# Altium schematic sheet [10] - ETHERNET.SchDoc
size A3; DocumentNumber: 2; SheetNumber: 10; SheetTotal: 20
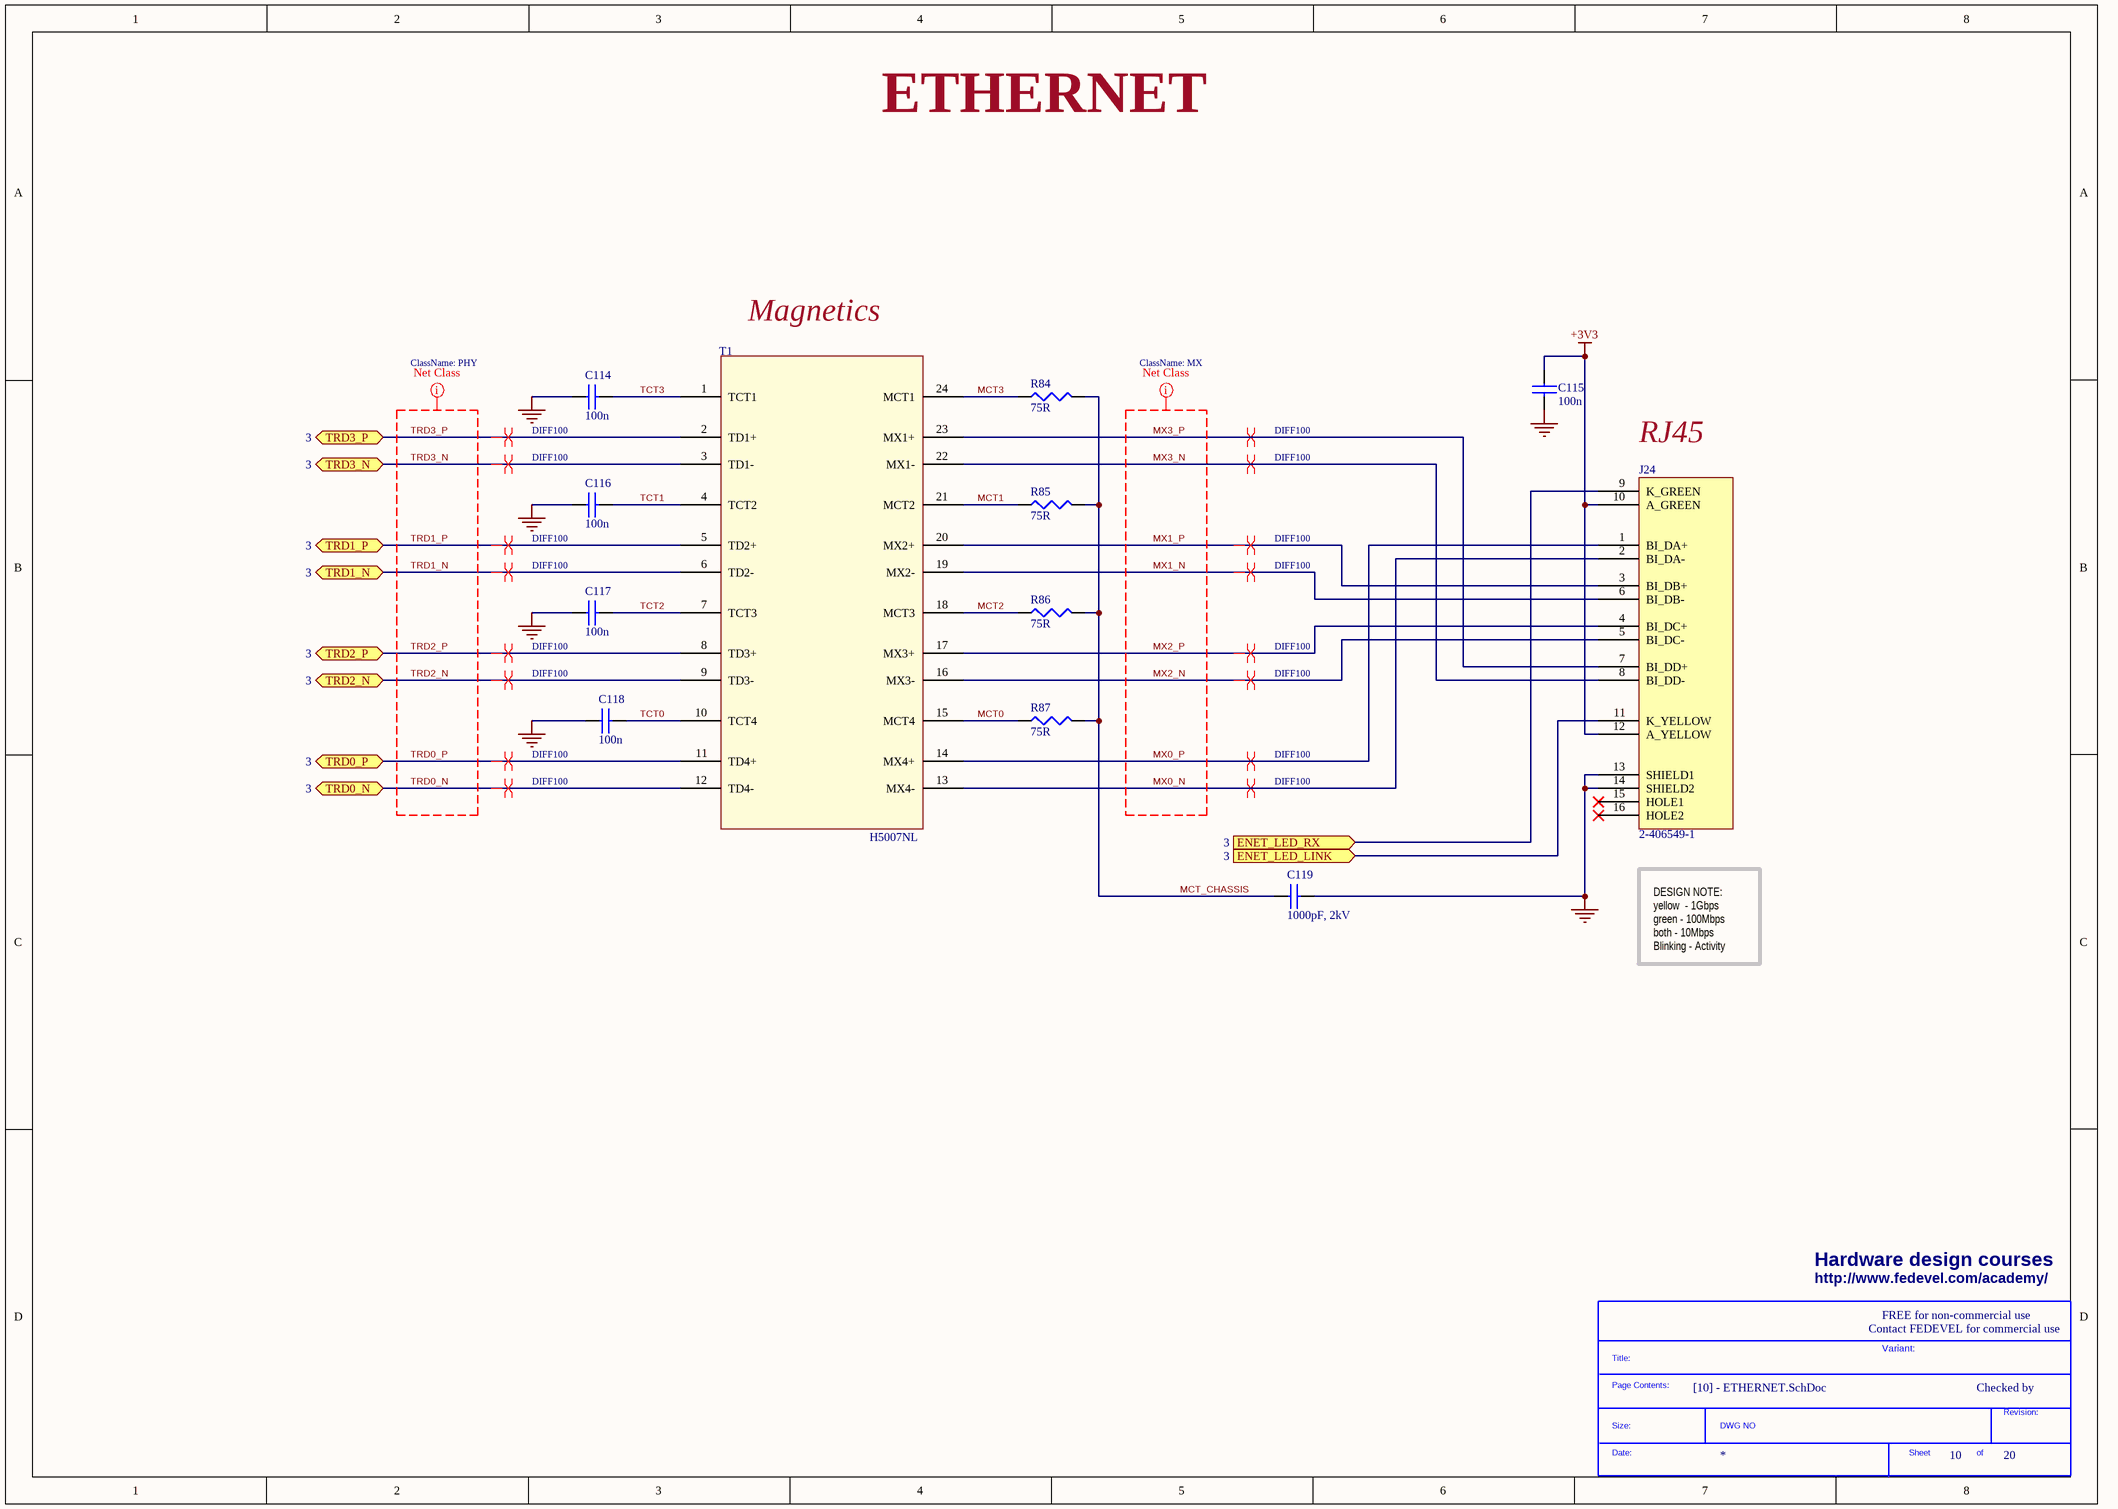
[diagram p0: [10] - ETHERNET.SchDoc]

## Parts
*  SDTitleBlock  (value not drawn)  (graphical)
C114  100n  [C0402]
C115  100n  [C0402]
C116  100n  [C0402]
C117  100n  [C0402]
C118  100n  [C0402]
C119  1000pF, 2kV  [C1206]
J24  2-406549-1  [RJ45LED]
R84  75R  [R0402]
R85  75R  [R0402]
R86  75R  [R0402]
R87  75R  [R0402]
T1  H5007NL  [H5007NL]

## Ports
ENET_LED_LINK (in, see 3), ENET_LED_RX (in, see 3), TRD0_N (bidir, see 3), TRD0_P (bidir, see 3), TRD1_N (bidir, see 3), TRD1_P (bidir, see 3), TRD2_N (bidir, see 3), TRD2_P (bidir, see 3), TRD3_N (bidir, see 3), TRD3_P (bidir, see 3)

## Nets
+3V3: C115.1 J24.10(A_GREEN) J24.12(A_YELLOW)
GND: C114.1 C115.2 C116.1 C117.1 C118.1 C119.2 J24.13(SHIELD1) J24.14(SHIELD2)
ENET_LED_LINK: J24.11(K_YELLOW) ; port ENET_LED_LINK
ENET_LED_RX: J24.9(K_GREEN) ; port ENET_LED_RX
MCT0: R87.1 T1.15(MCT4)
MCT1: R85.1 T1.21(MCT2)
MCT2: R86.1 T1.18(MCT3)
MCT3: R84.1 T1.24(MCT1)
MCT_CHASSIS: C119.1 R84.2 R85.2 R86.2 R87.2
MX0_N: J24.2(BI_DA-) T1.13(MX4-)
MX0_P: J24.1(BI_DA+) T1.14(MX4+)
MX1_N: J24.6(BI_DB-) T1.19(MX2-)
MX1_P: J24.3(BI_DB+) T1.20(MX2+)
MX2_N: J24.5(BI_DC-) T1.16(MX3-)
MX2_P: J24.4(BI_DC+) T1.17(MX3+)
MX3_N: J24.8(BI_DD-) T1.22(MX1-)
MX3_P: J24.7(BI_DD+) T1.23(MX1+)
TCT0: C118.2 T1.10(TCT4)
TCT1: C116.2 T1.4(TCT2)
TCT2: C117.2 T1.7(TCT3)
TCT3: C114.2 T1.1(TCT1)
TRD0_N: T1.12(TD4-) ; port TRD0_N
TRD0_P: T1.11(TD4+) ; port TRD0_P
TRD1_N: T1.6(TD2-) ; port TRD1_N
TRD1_P: T1.5(TD2+) ; port TRD1_P
TRD2_N: T1.9(TD3-) ; port TRD2_N
TRD2_P: T1.8(TD3+) ; port TRD2_P
TRD3_N: T1.3(TD1-) ; port TRD3_N
TRD3_P: T1.2(TD1+) ; port TRD3_P

Not connected (* = marked no-connect by the designer): J24 15(HOLE1)* 16(HOLE2)*

## Layout directives
differential pair; net class DIFF100: MX0_N, MX0_P, MX1_N, MX1_P, MX2_N, MX2_P, MX3_N, MX3_P, TRD0_N, TRD0_P, TRD1_N, TRD1_P, TRD2_N, TRD2_P, TRD3_N, TRD3_P
net class PHY: TRD0_N, TRD0_P, TRD1_N, TRD1_P, TRD2_N, TRD2_P, TRD3_N, TRD3_P
net class MX: MX0_N, MX0_P, MX1_N, MX1_P, MX2_N, MX2_P, MX3_N, MX3_P

## Notes on the sheet
- ETHERNET
- Magnetics
- (near J24) RJ45
- DESIGN NOTE:
  yellow  - 1Gbps
  green - 100Mbps
  both - 10Mbps
  Blinking - Activity
- Hardware design courses
- http://www.fedevel.com/academy/
- Contact FEDEVEL for commercial use
- FREE for non-commercial use
- Variant:
- Checked by
- (in symbol SDTitleBlock) Title:; Page Contents:; Revision:; Size:; DWG NO; Date:; Sheet; of

## Library data of the parts
C114-C118 = C1005X5R1H104K: CAP CER .10UF 50V X5R 10% 0402; Manufacturer: TDK Corporation; Capacitance: 0.1µF; Value: 100nF; .Checked PCB: used; Description: CAP CER 0.1UF 50V 10% X5R 0402; Category: Capacitors; Supplier Part Number: 445-5942-1-ND; Manufacturer Part Number: C1005X5R1H104K; Operating Temperature: -55°C ~ 85°C; Package / Case: 0402 (1005 Metric); Price 1k [$]: 0.02340; .Checked SCH: used; Voltage - Rated: 50V; Supplier: Digikey; Supplier 1: Digi-Key; Supplier Part Number 1: 445-5942-1-ND; RoHS: RoHS Compliant; Stock 1: 106926; Pricing 1: 1=0.27, 10=0.18, 100=0.072, 250=0.05176, 500=0.0369, 1000=0.027 (USD); Tolerance: ±10%; Temperature Coefficient: X5R; Mounting Type: Surface Mount, MLCC; Applications: General Purpose; Ratings: -; Size / Dimension: 0.039" L x 0.020" W (1.00mm x 0.50mm); Height - Seated (Max): -; Thickness (Max): 0.022" (0.55mm); Lead Spacing: -; Features: -; Packaging: Cut Tape (CT); Lead Style: -; ComponentLink1URL: http://www.tdk.co.jp/tefe02/e412_c.pdf; ComponentLink1Description: http://www.tdk.co.jp/tefe02/e412_c.pdf
C119 = C1206X102KGRACTU: CAP CER 1000PF 2000V X7R 1206 FT; Manufacturer: Kemet; .Checked PCB: used; Voltage - Rated: 2000V (2kV); Description: CAP CER 1000PF 2KV 10% X7R 1206; Tolerance: ±10%; Capacitance: 1000pF; Category: Capacitors; Supplier Part Number: 399-5830-1-ND; Manufacturer Part Number: C1206X102KGRACTU; Operating Temperature: -55°C ~ 125°C; Package / Case: 1206 (3216 Metric); Price 1k [$]: 0.27600; Value: 1000pF, 2kV; .Checked SCH: used; Supplier: Digikey; Supplier 1: Digi-Key; Supplier Part Number 1: 399-5830-1-ND; RoHS: RoHS Compliant; Stock 1: 2068; Pricing 1: 1=0.92, 10=0.771, 25=0.6324, 100=0.483, 250=0.37952, 500=0.345, 1000=0.276 (USD); Temperature Coefficient: X7R; Mounting Type: Surface Mount, MLCC; Applications: Boardflex Sensitive; Ratings: -; Size / Dimension: 0.134" L x 0.063" W (3.40mm x 1.60mm); Height - Seated (Max): -; Thickness (Max): 0.069" (1.75mm); Lead Spacing: -; Features: Soft Termination, High Voltage; Packaging: Cut Tape (CT); Lead Style: -; ComponentLink1URL: http://www.kemet.com/kemet/web/homepage/kechome.nsf/weben/8311688D32A99EF8852578B500644843/$file/KEM_CC105_HIVOLT.pdf; ComponentLink1Description: http://www.kemet.com/kemet/web/homepage/kechome.nsf/weben/8311688D32A99EF8852578B500644843/$file/KEM_CC105_HIVOLT.pdf
J24 = 2-406549-1: CONN MOD JACK 8POS R/A G-Y PCB; Manufacturer: Tyco; .Checked PCB: used; Number of Positions: 8p8c (RJ45, Ethernet); Description: CONN MOD JACK 8POS R/A Y-G PCB; Number of Ports: 1; Shielding: Shielded, EMI Finger; Ratings: Cat5; LED Color: Yellow - Green; Tab Direction: Up; .Checked SCH: used; Category: Connectors, Interconnects; Connector Type: Jack; Manufacturer Part Number: 2-406549-1; Price 1k [$]: 1.73278; Supplier: Digikey; Supplier Part Number: A97715-ND; Value: 2-406549-1; Supplier 1: Digi-Key; Supplier Part Number 1: A97715-ND; RoHS: RoHS Compliant; Stock 1: 9021; Pricing 1: 1=3.42 (USD); Number of Positions/Contacts: 8p8c (RJ45, Ethernet); Number of Rows: 1; Mounting Type: Through Hole; Orientation: 90° Angle (Right); Termination: Solder; Features: Board Lock; Packaging: Tray; Housing Material: Thermoplastic; Contact Material: Phosphor Bronze; Contact Finish: Gold; Operating Temperature: -40°C ~ 85°C; ComponentLink1URL: http://documents.tycoelectronics.com/commerce/DocumentDelivery/DDEController?Action=srchrtrv&DocNm=406549&DocType=CD&DocLang=EN; ComponentLink1Description: http://documents.tycoelectronics.com/commerce/DocumentDelivery/DDEController?Action=srchrtrv&DocNm=406549&DocType=CD&DocLang=EN
R84-R87 = RC0402FR-0775RL: RES 75.0 OHM 1/16W 1% 0402 SMD; Manufacturer: Yageo; Resistance (Ohms): 75; Power (Watts): 0.063W, 1/16W; .Checked PCB: used; Temperature Coefficient: ±100ppm/°C; Category: Resistors; Supplier Part Number: 311-75.0LRCT-ND; Manufacturer Part Number: RC0402FR-0775RL; Package / Case: 0402 (1005 Metric); Price 1k [$]: 0.00288; Tolerance: ±1%; Value: 75R; .Checked SCH: used; Supplier: Digikey; Supplier 1: Digi-Key; Supplier Part Number 1: 311-75.0LRCT-ND; RoHS: RoHS Compliant; Stock 1: 0; Pricing 1: 10=0.014, 50=0.0104, 100=0.0079, 250=0.00584, 500=0.00432, 1000=0.00288 (USD); Composition: Thick Film; Features: -; Size / Dimension: 0.039" L x 0.020" W (1.00mm x 0.50mm); Height: 0.016" (0.40mm); Number of Terminations: 2; Packaging: Cut Tape (CT); ComponentLink1URL: http://www.yageo.com/documents/recent/PYu-RC0402_51_RoHS_L_6.pdf; ComponentLink1Description: http://www.yageo.com/documents/recent/PYu-RC0402_51_RoHS_L_6.pdf
T1 = H5007NL: MODULE SINGLE GIGABIT LAN 24SOIC; Manufacturer: PULSE ELECTRONICS CORPORATION; .Checked PCB: MM; Transformer Type: Isolation and Data Interface (Encapsulated); Turns Ratio - Primary:Secondary: 1CT : 1CT; Category: Transformers; Family: Pulse; Manufacturer Part Number: H5007NL; Operating Temperature: 0°C ~ 70°C; Price 1k [$]: 3.25125; Supplier: Digikey; Supplier Part Number: 553-1334-ND; .Checked SCH: MM; Supplier 1: Digi-Key; Supplier Part Number 1: 553-1334-ND; RoHS: RoHS Compliant; Stock 1: 15654; Pricing 1: 1=5.74, 10=5.1, 100=4.08, 250=3.69752, 500=3.50626, 1000=3.25125, 5000=3.162 (USD); Inductance: -; E.T.: -; Mounting Type: Surface Mount; Size / Dimension: 17.53mm L x 12.20mm W; Height - Seated (Max): 5.76mm; ComponentLink1URL: http://ww2.pulseeng.com/products/datasheets/HC500.pdf; ComponentLink1Description: http://ww2.pulseeng.com/products/datasheets/HC500.pdf